# Altium schematic sheet Reefing-IO.SchDoc: Reefing System
size A4; DocumentNumber: Subtitle; Revision: V1.0; SheetNumber: 13; SheetTotal: 13; Author: Luca Jost; Subtitle: IO
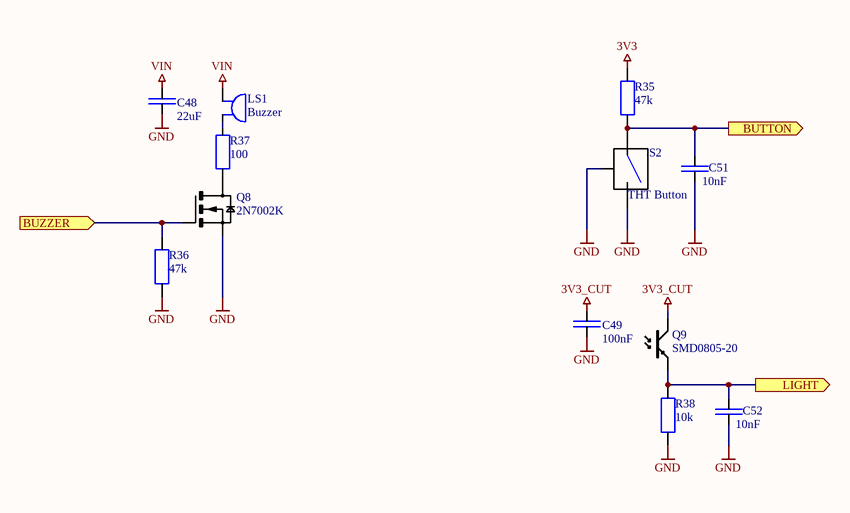
[diagram p0: Reefing-IO.SchDoc]

## Parts
C48  22uF  [SMD Keramikkondensator 0805]
C49  100nF  [SMD Keramikkondensator 0402]
C51  10nF  [SMD Keramikkondensator 0402]
C52  10nF  [SMD Keramikkondensator 0402]
LS1  Buzzer  [SMD BUZZER CMT-8504]
Q8  2N7002K  [SMD MOSFET SOT-23]
Q9  SMD0805-20  [SMD LED 0805]
R35  47k  [SMD Widerstand 0402]
R36  47k  [SMD Widerstand 0402]
R37  100  [SMD Widerstand 0805]
R38  10k  [SMD Widerstand 0402]
S2  THT Button  [THT Button Right Angle]

## Ports
BUTTON (out), BUZZER (in), LIGHT (out)

## Nets
3V3: R35.1
3V3_CUT: C49.2 Q9.A
GND: C48.1 C49.1 C51.1 C52.1 Q8.S R36.1 R38.1 S2.1 S2.3
VIN: C48.2 LS1.1
BUTTON: C51.2 R35.2 S2.2 ; port BUTTON
BUZZER: Q8.G R36.2 ; port BUZZER
LIGHT: C52.2 Q9.K R38.2 ; port LIGHT
NetLS1_2: LS1.2 R37.2
NetQ8_D: Q8.D R37.1

## Notes on the sheet
- Title
- Author:
- Subtitle
- Date:
- Rev:
- File:
- Sheet
- of

## Library data of the parts
C48 = E6 - 22uF: SMD Ceramic Capacitor E6; Unit Price: 0.01; JLC: C45783
C49 = E6 - 100nF: SMD Ceramic Capacitor E6; Unit Price: 0.01; JLC: C307331
C51 C52 = E6 - 10nF: SMD Ceramic Capacitor E6; Unit Price: 0.01; JLC: C15195
LS1 = Buzzer: Buzzers Indicator, Internally Driven Piezo 12V 10mA 3kHz 100dB @ 12V, 10cm Through Hole PC Pins; ComponentLink1Description: Datasheet; ComponentLink1URL: https://dbunlimitedco.com/images/product_images/2D-Drawings/IP303012-1.pdf; JLC: C255315; Unit Price: 0.59
Q8 = 2N7002K: MOSFET N-Channel 60V / 500mA; Digikey: 2N7002NCT-ND; ComponentLink1Description: Datasheet; ComponentLink1URL: https://www.onsemi.com/pub/Collateral/NDS7002A-D.PDF; JLC: C414015; Unit Price: 0.32
R35 R36 = E24 - 47k: SMD Chip Resistor E24; Unit Price: 0.01; JLC: C25792
R37 = E24 - 100: SMD Chip Resistor E24; Unit Price: 0.01; JLC: C515718
R38 = E24 - 10k: SMD Chip Resistor E24; Unit Price: 0.01; JLC: C25744
S2 = Button SPST-NO Right Angle: Tactile Switch SPST-NO Side Actuated Through Hole, Right Angle; ComponentLink1Description: Datasheet; ComponentLink1URL: https://www.te.com/commerce/DocumentDelivery/DDEController?Action=srchrtrv&DocNm=1825027&DocType=Customer+Drawing&DocLang=English; Digikey: A109320-ND; Digikey Alt: 450-1660-ND; Unit Price: 0.35
Q9 = SMD0805-20: JLC: C250858; ComponentLink1Description: Datasheet; ComponentLink1URL: https://datasheet.lcsc.com/lcsc/1809172049_Senba-Sensing-Tech-SMD0805-20_C250858.pdf; Unit Price: 0.11